# Altium schematic sheet VOU_SOM_CV_V0.0.1.SchDoc
size 593 x 419 mm; DocumentNumber: 1; SheetNumber: 1; SheetTotal: 12; Razrabotal: Савицкий
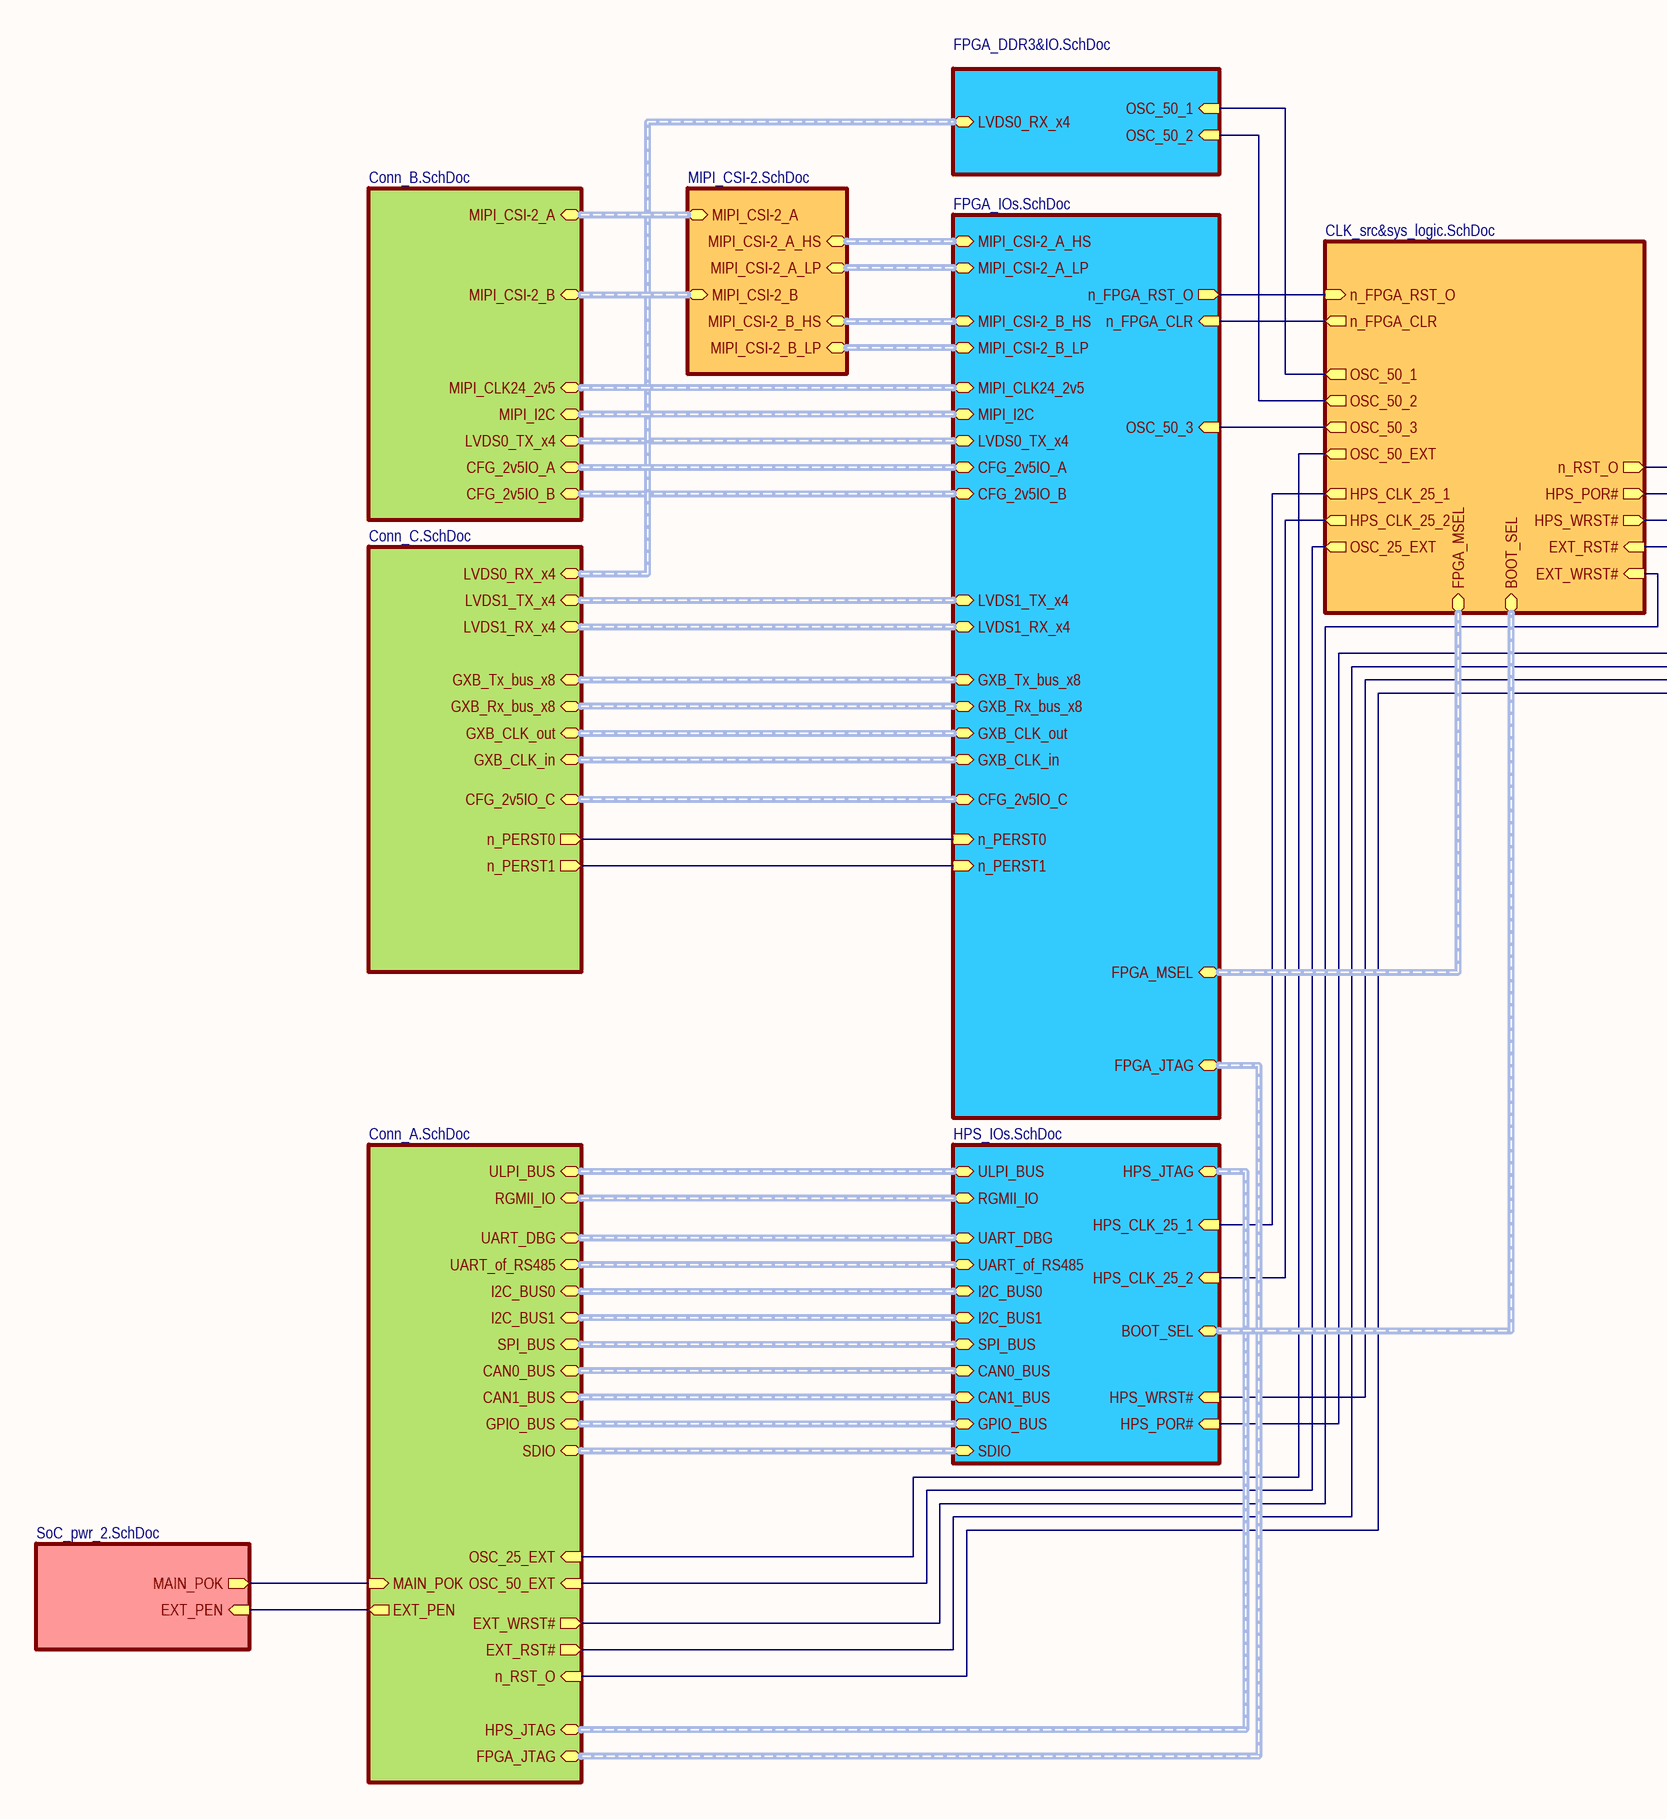
[diagram p0: VOU_SOM_CV_V0.0.1.SchDoc, left]
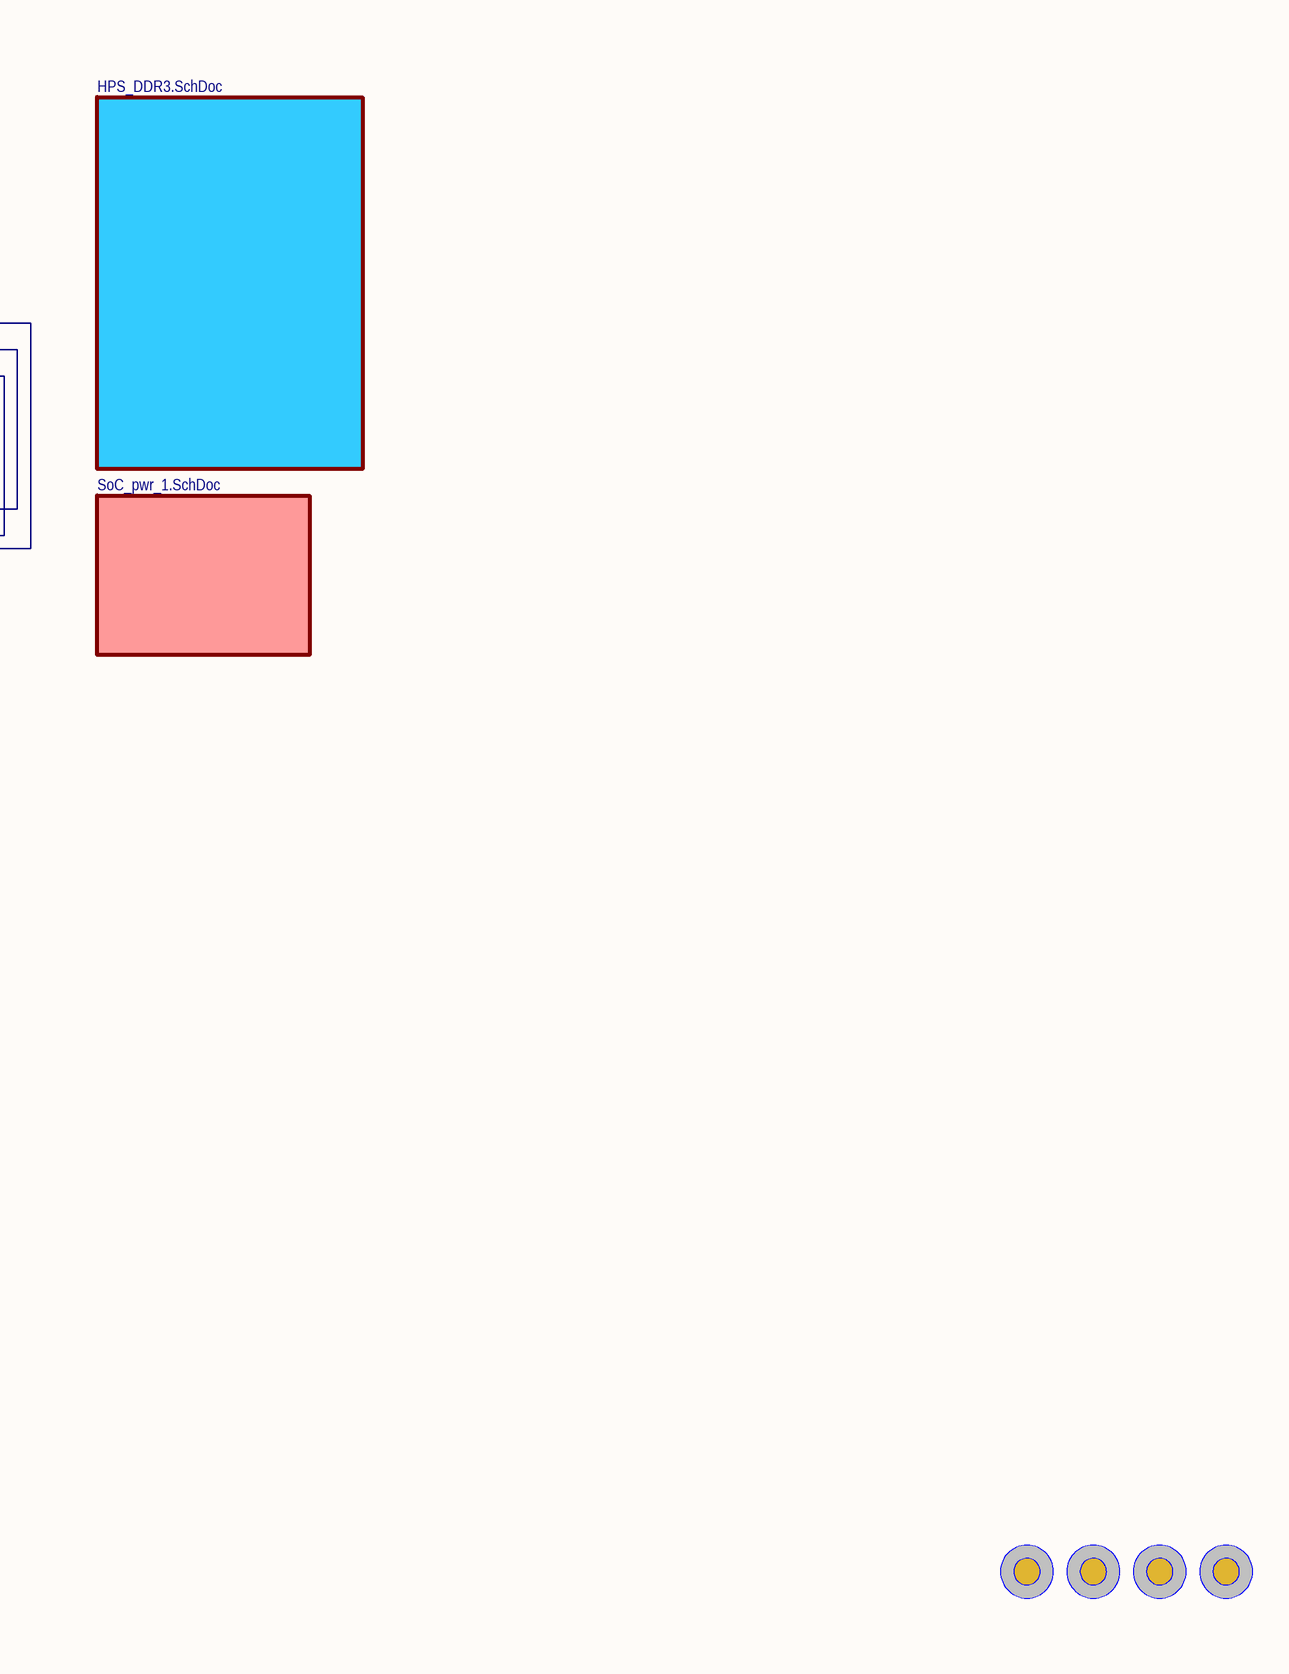
[diagram p1: VOU_SOM_CV_V0.0.1.SchDoc, right]

## Parts
RP_BL  Comment  [Reper-Normal]  (value not drawn)  (no BOM)
RP_BR  Comment  [Reper-Normal]  (value not drawn)  (no BOM)
RP_LT  Comment  [Reper-Normal]  (value not drawn)  (no BOM)
RP_RT  Comment  [Reper-Normal]  (value not drawn)  (no BOM)

## Sub-sheets
CLK_src&sys_logic.SchDoc = CLK_src&sys_logic.SchDoc: HPS_CLK_25_1 (out), HPS_CLK_25_2 (out), OSC_50_1 (out), OSC_50_2 (out), OSC_50_3 (out), OSC_50_EXT (out), OSC_25_EXT (out), EXT_RST# (in), HPS_WRST# (out), HPS_POR# (out), FPGA_MSEL (harness FPGA_MSEL), BOOT_SEL (harness BOOT_SEL), n_FPGA_RST_O (in), n_FPGA_CLR (out), EXT_WRST# (in), n_RST_O (out)
Conn_A.SchDoc = Conn_A.SchDoc: MAIN_POK (in), EXT_PEN (out), ULPI_BUS (harness ULPI_BUS), RGMII_IO (harness RGMII_IO), UART_DBG (harness UART_DBG), UART_of_RS485 (harness UART_of_RS485), I2C_BUS0 (harness I2C_BUS0), I2C_BUS1 (harness I2C_BUS1), SPI_BUS (harness SPI_BUS), CAN0_BUS (harness CAN0_BUS), GPIO_BUS (harness GPIO_BUS), SDIO (harness SDIO), OSC_50_EXT (in), OSC_25_EXT (in), n_RST_O (in), HPS_JTAG (harness HPS_JTAG), FPGA_JTAG (harness FPGA_JTAG), EXT_RST# (out), EXT_WRST# (out), CAN1_BUS (harness CAN1_BUS)
Conn_B.SchDoc = Conn_B.SchDoc: MIPI_CSI-2_A (harness MIPI_CSI-2_A), MIPI_CSI-2_B (harness MIPI_CSI-2_B), LVDS0_TX_x4 (harness LVDS0_TX_x4), MIPI_I2C (harness MIPI_I2C), MIPI_CLK24_2v5 (harness MIPI_CLK24_2v5), CFG_2v5IO_A (harness CFG_2v5IO_A), CFG_2v5IO_B (harness CFG_2v5IO_B)
Conn_C.SchDoc = Conn_C.SchDoc: GXB_Tx_bus_x8 (harness GXB_Tx_bus_x8), GXB_Rx_bus_x8 (harness GXB_Rx_bus_x8), LVDS0_RX_x4 (harness LVDS0_RX_x4), LVDS1_TX_x4 (harness LVDS1_TX_x4), LVDS1_RX_x4 (harness LVDS1_RX_x4), GXB_CLK_out (harness GXB_CLK_out), GXB_CLK_in (harness GXB_CLK_in), CFG_2v5IO_С (harness CFG_2v5IO_С), n_PERST0 (out), n_PERST1 (out)
DIMS_DSP_MainBoard_Interface.SchDoc = MIPI_CSI-2.SchDoc: MIPI_CSI-2_B_HS (harness MIPI_CSI-2_B_HS), MIPI_CSI-2_B_LP (harness MIPI_CSI-2_B_LP), MIPI_CSI-2_A_HS (harness MIPI_CSI-2_A_HS), MIPI_CSI-2_A_LP (harness MIPI_CSI-2_A_LP), MIPI_CSI-2_A (harness MIPI_CSI-2_A), MIPI_CSI-2_B (harness MIPI_CSI-2_B)
FPGA_DDR3&IO.SchDoc = FPGA_DDR3&IO.SchDoc: OSC_50_1 (in), OSC_50_2 (in), LVDS0_RX_x4 (harness LVDS0_RX_x4)
FPGA_IOs.SchDoc = FPGA_IOs.SchDoc: MIPI_CSI-2_B_LP (harness MIPI_CSI-2_B_LP), MIPI_CSI-2_A_LP (harness MIPI_CSI-2_A_LP), MIPI_CSI-2_A_HS (harness MIPI_CSI-2_A_HS), CFG_2v5IO_B (harness CFG_2v5IO_B), GXB_Tx_bus_x8 (harness GXB_Tx_bus_x8), GXB_Rx_bus_x8 (harness GXB_Rx_bus_x8), GXB_CLK_out (harness GXB_CLK_out), FPGA_JTAG (harness FPGA_JTAG), FPGA_MSEL (harness FPGA_MSEL), OSC_50_3 (in), MIPI_CLK24_2v5 (harness MIPI_CLK24_2v5), MIPI_CSI-2_B_HS (harness MIPI_CSI-2_B_HS), MIPI_I2C (harness MIPI_I2C), LVDS0_TX_x4 (harness LVDS0_TX_x4), LVDS1_TX_x4 (harness LVDS1_TX_x4), LVDS1_RX_x4 (harness LVDS1_RX_x4), GXB_CLK_in (harness GXB_CLK_in), CFG_2v5IO_A (harness CFG_2v5IO_A), CFG_2v5IO_С (harness CFG_2v5IO_С), n_PERST0 (in), n_PERST1 (in), n_FPGA_RST_O (out), n_FPGA_CLR (in)
HPS_DDR3.SchDoc = HPS_DDR3.SchDoc: no entries
HPS_IOs.SchDoc = HPS_IOs.SchDoc: ULPI_BUS (harness ULPI_BUS), RGMII_IO (harness RGMII_IO), UART_DBG (harness UART_DBG), UART_of_RS485 (harness UART_of_RS485), I2C_BUS0 (harness I2C_BUS0), I2C_BUS1 (harness I2C_BUS1), SPI_BUS (harness SPI_BUS), CAN0_BUS (harness CAN0_BUS), GPIO_BUS (harness GPIO_BUS), HPS_JTAG (harness HPS_JTAG), SDIO (harness SDIO), HPS_CLK_25_1 (in), HPS_CLK_25_2 (in), HPS_WRST# (in), HPS_POR# (in), BOOT_SEL (harness BOOT_SEL), CAN1_BUS (harness CAN1_BUS)
SoC_pwr_1.SchDoc = SoC_pwr_1.SchDoc: no entries
SoC_pwr_2.SchDoc = SoC_pwr_2.SchDoc: MAIN_POK (out), EXT_PEN (in)

## Nets
(unnamed): sheet FPGA_DDR3&IO.SchDoc/OSC_50_1, sheet CLK_src&sys_logic.SchDoc/OSC_50_1
(unnamed): sheet FPGA_DDR3&IO.SchDoc/OSC_50_2, sheet CLK_src&sys_logic.SchDoc/OSC_50_2
(unnamed): sheet Conn_A.SchDoc/MAIN_POK, sheet SoC_pwr_2.SchDoc/MAIN_POK
(unnamed): sheet Conn_A.SchDoc/EXT_PEN, sheet SoC_pwr_2.SchDoc/EXT_PEN
(unnamed): sheet Conn_A.SchDoc/OSC_50_EXT, sheet CLK_src&sys_logic.SchDoc/OSC_25_EXT
(unnamed): sheet Conn_A.SchDoc/OSC_25_EXT, sheet CLK_src&sys_logic.SchDoc/OSC_50_EXT
(unnamed): sheet Conn_A.SchDoc/n_RST_O, sheet CLK_src&sys_logic.SchDoc/n_RST_O
(unnamed): sheet Conn_A.SchDoc/EXT_RST#, sheet CLK_src&sys_logic.SchDoc/EXT_RST#
(unnamed): sheet Conn_A.SchDoc/EXT_WRST#, sheet CLK_src&sys_logic.SchDoc/EXT_WRST#
(unnamed): sheet Conn_C.SchDoc/n_PERST0, sheet FPGA_IOs.SchDoc/n_PERST0
(unnamed): sheet Conn_C.SchDoc/n_PERST1, sheet FPGA_IOs.SchDoc/n_PERST1
(unnamed): sheet FPGA_IOs.SchDoc/OSC_50_3, sheet CLK_src&sys_logic.SchDoc/OSC_50_3
(unnamed): sheet FPGA_IOs.SchDoc/n_FPGA_RST_O, sheet CLK_src&sys_logic.SchDoc/n_FPGA_RST_O
(unnamed): sheet FPGA_IOs.SchDoc/n_FPGA_CLR, sheet CLK_src&sys_logic.SchDoc/n_FPGA_CLR
(unnamed): sheet HPS_IOs.SchDoc/HPS_CLK_25_1, sheet CLK_src&sys_logic.SchDoc/HPS_CLK_25_1
(unnamed): sheet HPS_IOs.SchDoc/HPS_CLK_25_2, sheet CLK_src&sys_logic.SchDoc/HPS_CLK_25_2
(unnamed): sheet HPS_IOs.SchDoc/HPS_WRST#, sheet CLK_src&sys_logic.SchDoc/HPS_WRST#
(unnamed): sheet HPS_IOs.SchDoc/HPS_POR#, sheet CLK_src&sys_logic.SchDoc/HPS_POR#

## Buses and harness runs
harness sheet CLK_src&sys_logic.SchDoc/BOOT_SEL = sheet HPS_IOs.SchDoc/BOOT_SEL
harness sheet CLK_src&sys_logic.SchDoc/FPGA_MSEL = sheet FPGA_IOs.SchDoc/FPGA_MSEL
harness sheet Conn_A.SchDoc/CAN0_BUS = sheet HPS_IOs.SchDoc/CAN0_BUS
harness sheet Conn_A.SchDoc/CAN1_BUS = sheet HPS_IOs.SchDoc/CAN1_BUS
harness sheet Conn_A.SchDoc/FPGA_JTAG = sheet FPGA_IOs.SchDoc/FPGA_JTAG
harness sheet Conn_A.SchDoc/GPIO_BUS = sheet HPS_IOs.SchDoc/GPIO_BUS
harness sheet Conn_A.SchDoc/HPS_JTAG = sheet HPS_IOs.SchDoc/HPS_JTAG
harness sheet Conn_A.SchDoc/I2C_BUS0 = sheet HPS_IOs.SchDoc/I2C_BUS0
harness sheet Conn_A.SchDoc/I2C_BUS1 = sheet HPS_IOs.SchDoc/I2C_BUS1
harness sheet Conn_A.SchDoc/RGMII_IO = sheet HPS_IOs.SchDoc/RGMII_IO
harness sheet Conn_A.SchDoc/SDIO = sheet HPS_IOs.SchDoc/SDIO
harness sheet Conn_A.SchDoc/SPI_BUS = sheet HPS_IOs.SchDoc/SPI_BUS
harness sheet Conn_A.SchDoc/UART_DBG = sheet HPS_IOs.SchDoc/UART_DBG
harness sheet Conn_A.SchDoc/UART_of_RS485 = sheet HPS_IOs.SchDoc/UART_of_RS485
harness sheet Conn_A.SchDoc/ULPI_BUS = sheet HPS_IOs.SchDoc/ULPI_BUS
harness sheet Conn_B.SchDoc/CFG_2v5IO_A = sheet FPGA_IOs.SchDoc/CFG_2v5IO_A
harness sheet Conn_B.SchDoc/CFG_2v5IO_B = sheet FPGA_IOs.SchDoc/CFG_2v5IO_B
harness sheet Conn_B.SchDoc/LVDS0_TX_x4 = sheet FPGA_IOs.SchDoc/LVDS0_TX_x4
harness sheet Conn_B.SchDoc/MIPI_CLK24_2v5 = sheet FPGA_IOs.SchDoc/MIPI_CLK24_2v5
harness sheet Conn_B.SchDoc/MIPI_CSI-2_A = sheet DIMS_DSP_MainBoard_Interface.SchDoc/MIPI_CSI-2_A
harness sheet Conn_B.SchDoc/MIPI_CSI-2_B = sheet DIMS_DSP_MainBoard_Interface.SchDoc/MIPI_CSI-2_B
harness sheet Conn_B.SchDoc/MIPI_I2C = sheet FPGA_IOs.SchDoc/MIPI_I2C
harness sheet Conn_C.SchDoc/CFG_2v5IO_С = sheet FPGA_IOs.SchDoc/CFG_2v5IO_С
harness sheet Conn_C.SchDoc/GXB_CLK_in = sheet FPGA_IOs.SchDoc/GXB_CLK_in
harness sheet Conn_C.SchDoc/GXB_CLK_out = sheet FPGA_IOs.SchDoc/GXB_CLK_out
harness sheet Conn_C.SchDoc/GXB_Rx_bus_x8 = sheet FPGA_IOs.SchDoc/GXB_Rx_bus_x8
harness sheet Conn_C.SchDoc/GXB_Tx_bus_x8 = sheet FPGA_IOs.SchDoc/GXB_Tx_bus_x8
harness sheet Conn_C.SchDoc/LVDS0_RX_x4 = sheet FPGA_DDR3&IO.SchDoc/LVDS0_RX_x4
harness sheet Conn_C.SchDoc/LVDS1_RX_x4 = sheet FPGA_IOs.SchDoc/LVDS1_RX_x4
harness sheet Conn_C.SchDoc/LVDS1_TX_x4 = sheet FPGA_IOs.SchDoc/LVDS1_TX_x4
harness sheet DIMS_DSP_MainBoard_Interface.SchDoc/MIPI_CSI-2_A_HS = sheet FPGA_IOs.SchDoc/MIPI_CSI-2_A_HS
harness sheet DIMS_DSP_MainBoard_Interface.SchDoc/MIPI_CSI-2_A_LP = sheet FPGA_IOs.SchDoc/MIPI_CSI-2_A_LP
harness sheet DIMS_DSP_MainBoard_Interface.SchDoc/MIPI_CSI-2_B_HS = sheet FPGA_IOs.SchDoc/MIPI_CSI-2_B_HS
harness sheet DIMS_DSP_MainBoard_Interface.SchDoc/MIPI_CSI-2_B_LP = sheet FPGA_IOs.SchDoc/MIPI_CSI-2_B_LP

## Notes on the sheet
- Перв. примен.
- Справ. №
- Подп. и дата
- Инв. № дубл.
- Взам. инв. №
- Изм.
- Лист
- № докум.
- Подп.
- Дата
- Лит.
- Масса
- Масштаб
- Разраб.
- Пров.
- Т.контр.
- Схема электрическая принципиальная
- Листов
- Инв. № подл.
- Н.контр.
- Утв.
- Копировал:
- Формат А2

## Library data of the parts
RP_BL RP_BR RP_LT RP_RT = Reper: Стабилизатор положительного напряжения